# Altium schematic sheet rev1.SchDoc
size A4
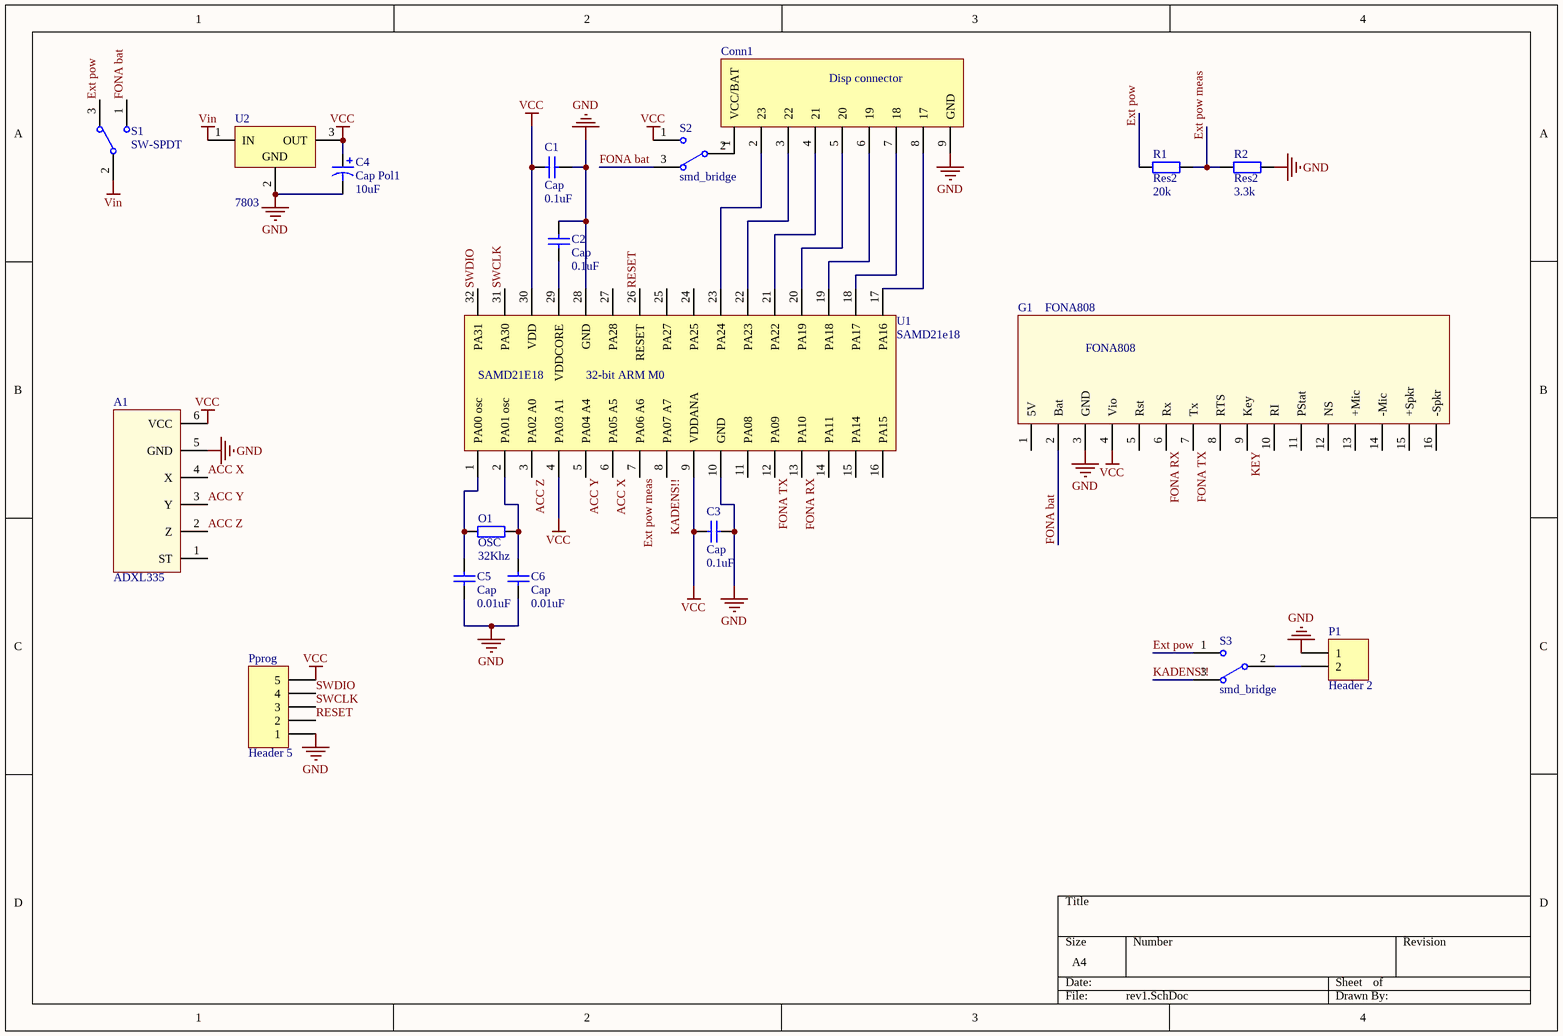
[diagram p0: rev1.SchDoc]

## Parts
A1  ADXL335  [ADXL]
C1  Cap  value 0.1uF  [R3216-1206]
C2  Cap  value 0.1uF  [R3216-1206]
C3  Cap  value 0.1uF  [R3216-1206]
C4  Cap Pol1  value 10uF  [RB5-10.5]
C5  Cap  value 0.01uF  [R2012-0805]
C6  Cap  value 0.01uF  [R2012-0805]
Conn1  Disp connector  [9pin 2.54]
G1  FONA808  [FONA808]
O1  OSC  value 32Khz  [R2012-0805]
P1  Header 2  [HDR1X2]
Pprog  Header 5  [HDR1X5]
R1  Res2  value 20k  [R2012-0805]
R2  Res2  value 3.3k  [R2012-0805]
S1  SW-SPDT  [SW-SPDT2.54mm]
S2  smd_bridge  [SMD_BRIDGE]
S3  smd_bridge  [SMD_BRIDGE]
U1  SAMD21e18  [TQFP32_N]
U2  7803  [221A-04]

## Nets
GND: A1.5(GND) C1.1 C2.2 C3.1 C4.2 C5.1 C6.1 Conn1.9(GND) G1.3(GND) P1.1 Pprog.1 R2.2 U1.10(GND) U1.28(GND) U2.2(GND)
VCC: A1.6(VCC) C1.2 C3.2 C4.1 G1.4(Vio) Pprog.5 S2.1 U1.4(PA03_A1) U1.9(VDDANA) U1.30(VDD) U2.3(OUT)
Vin: S1.2 U2.1(IN)
ACC X: A1.4(X) U1.6(PA05_A5)
ACC Y: A1.3(Y) U1.5(PA04_A4)
ACC Z: A1.2(Z) U1.3(PA02_A0)
Ext pow: R1.1 S1.3 S3.1
Ext pow meas: R1.2 R2.1 U1.7(PA06_A6)
FONA bat: G1.2(Bat) S1.1 S2.3
FONA RX: G1.6(Rx) U1.13(PA10)
FONA TX: G1.7(Tx) U1.12(PA09)
KADENS!!: S3.3 U1.8(PA07_A7)
KEY: G1.9(Key)
RESET: Pprog.2 U1.26(RESET)
SWCLK: Pprog.3 U1.31(PA30)
SWDIO: Pprog.4 U1.32(PA31)
NetC2_1: C2.1 U1.29(VDDCORE)
NetC5_2: C5.2 O1.1 U1.1(PA00_osc)
NetC6_2: C6.2 O1.2 U1.2(PA01_osc)
NetConn1_1: Conn1.1(VCC/BAT) S2.2
NetConn1_2: Conn1.2(23) U1.23(PA24)
NetConn1_3: Conn1.3(22) U1.22(PA23)
NetConn1_4: Conn1.4(21) U1.21(PA22)
NetConn1_5: Conn1.5(20) U1.20(PA19)
NetConn1_6: Conn1.6(19) U1.19(PA18)
NetConn1_7: Conn1.7(18) U1.18(PA17)
NetConn1_8: Conn1.8(17) U1.17(PA16)
NetP1_2: P1.2 S3.2

Not connected (* = marked no-connect by the designer): A1 1(ST); G1 1(5V) 5(Rst) 8(RTS) 10(RI) 11(PStat) 12(NS) 13(+Mic) 14(-Mic) 15(+Spkr) 16(-Spkr); U1 11(PA08) 14(PA11) 15(PA14) 16(PA15) 24(PA25) 25(PA27) 27(PA28)

## Notes on the sheet
- (in symbol SAMD21e18) SAMD21E18; 32-bit ARM M0

## Library data of the parts
C1-C3 C5 C6 = Cap: Capacitor; Published: 8-Jun-2000; LatestRevisionDate: 17-Jul-2002; LatestRevisionNote: Re-released for DXP Platform.; PackageReference: RAD-0.3; Publisher: Altium Limited; PackageDescription: Radial Cap, Thru-Hole; 2 Leads; 0.3 in Pin Spacing
C4 = Cap Pol1: Polarized Capacitor (Radial); Published: 8-Jun-2000; LatestRevisionDate: 17-Jul-2002; LatestRevisionNote: Re-released for DXP Platform.; PackageReference: RB7.6-15; Publisher: Altium Limited; PackageDescription: Polarized Capacitor (Radial); 2 Leads
O1 R1 R2 = Res2: Resistor; Published: 8-Jun-2000; LatestRevisionDate: 17-Jul-2002; LatestRevisionNote: Re-released for DXP Platform.; PackageReference: AXIAL-0.4; Publisher: Altium Limited; PackageDescription: Axial Device, Thru-Hole; 2 Leads; 0.4 in Pin Spacing
P1 = Header 2: Header, 2-Pin; LatestRevisionDate: 17-Jul-2002; LatestRevisionNote: Re-released for DXP Platform.; Publisher: Altium Limited
Pprog = Header 5: Header, 5-Pin; LatestRevisionDate: 17-Jul-2002; LatestRevisionNote: Re-released for DXP Platform.; Publisher: Altium Limited
S1 = SW-SPDT: SPDT Subminiature Toggle Switch, Right Angle Mounting, Vertical Actuation; Published: 24-Mar-1999; LatestRevisionDate: 17-Dec-2003; LatestRevisionNote: Schematic revised, PCB Footprint replaced.; DatasheetVersion: 05-Dec-2000; PackageReference: TL36WW15050; Publisher: Altium Limited; PackageDescription: Switch; 4 Leads; ComponentLink1Description: Manufacturer Link; ComponentLink1URL: http://www.apem.com
U2 = 7803: 3-Terminal Positive Fixed Voltage Regulator; Note: Pin 2 is electrically connected to TAB; Published: 17-Jul-2002; DatasheetVersion: 1988; PackageReference: 221A-04; Publisher: Altium Limited; PackageDescription: TO, Thru-Hole, Vertical, Heatsink Mounted; 3 In-Line Leads; Pitch 2.54 mm; Code_JEDEC: TO-262-AA; ComponentLink1Description: Manufacturer Link; ComponentLink1URL: http://www.onsemi.com/site/products/taxonomy/0,4438,503,00.html; ComponentLink2Description: Datasheet; ComponentLink2URL: http://www.onsemi.com/pub/Collateral/MC7800-D.PDF